# EasyEDA Pro project 主轴转接板.eprj

# Schematic 原理图
Board Name: 转接隔离板; Create Date: 2024-04-22; Page Name: 主控MCU; Project Name: 主轴转接板; Schematic Name: 原理图; Update Date: 2025-02-19; Company: 嘉立创EDA; Page Size: A3; Version: V1.0
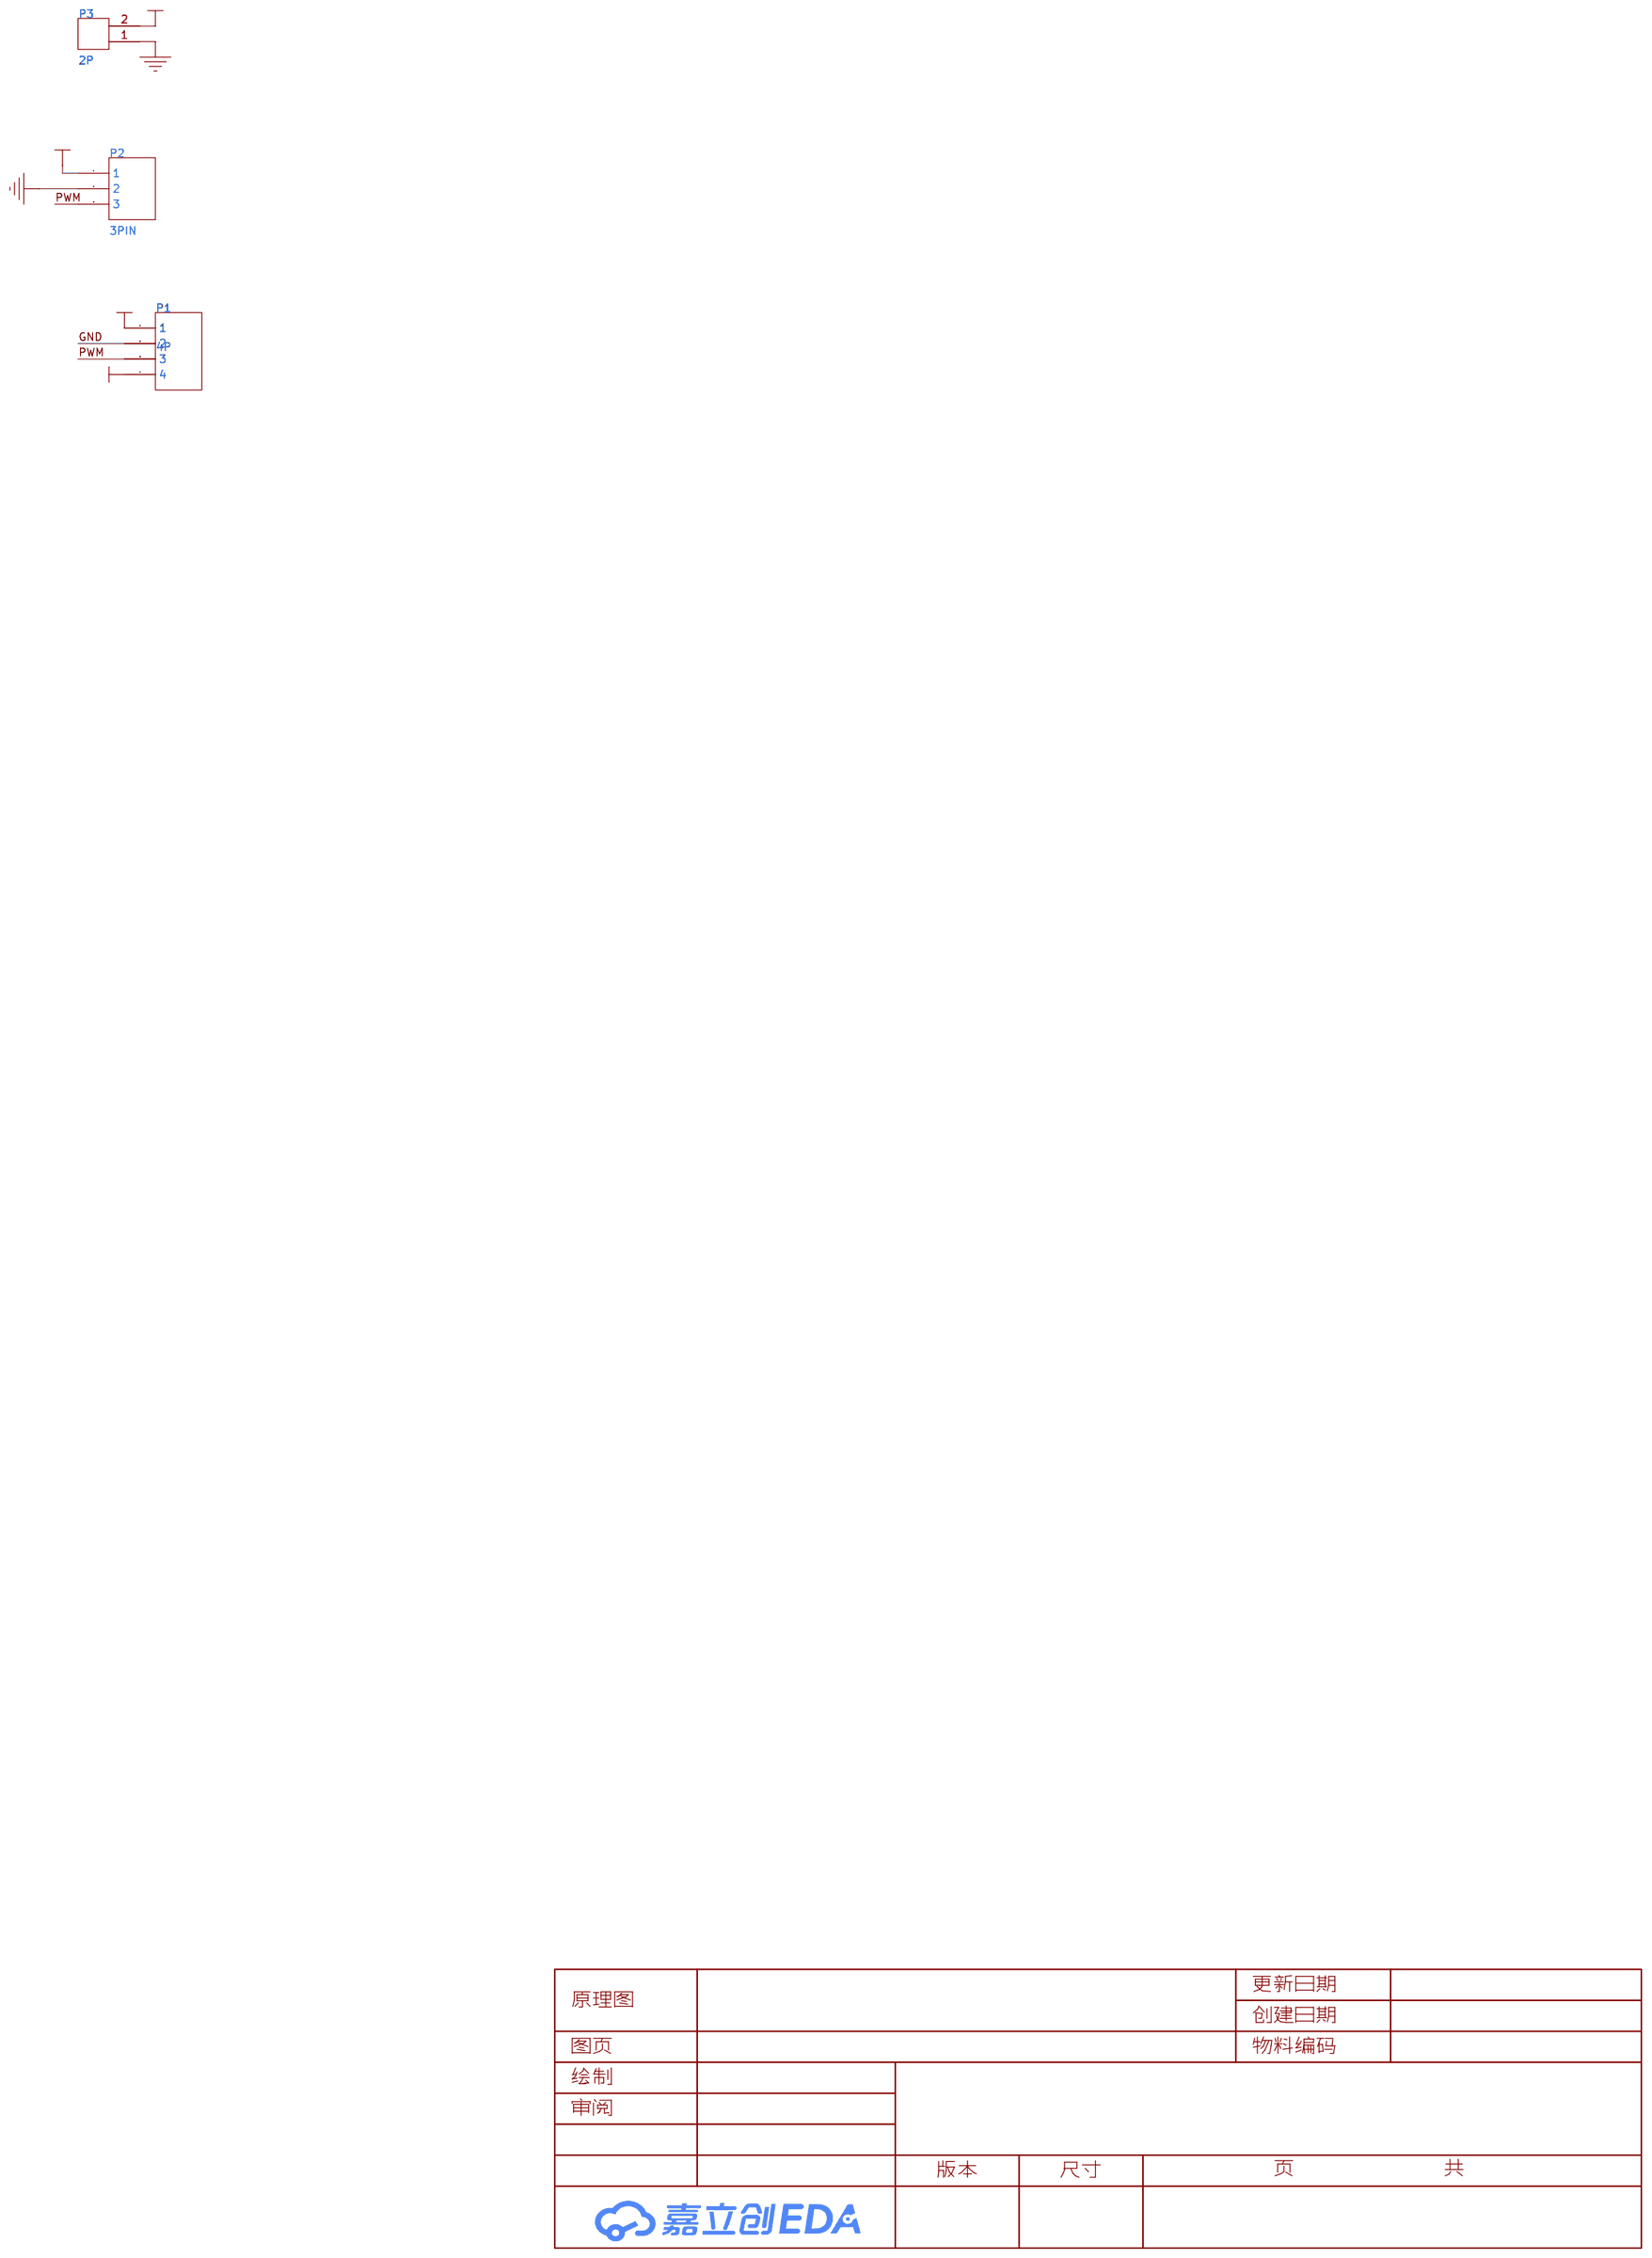
[diagram p0: schematic sheet]

## Parts
P1  4P  [SIP4]
P2  3PIN  [HDR1X3_P]
P3  2P  [HDR1X2_P]

## Library data of the parts
P1 = 4P: Library Name: SCH封装库
P2 = 3P: Library Name: SCH封装库
P3 = 2P: Library Name: SCH封装库

## Nets
12V: P1.4 P2.1
48V: P1.1 P3.2
GND: P1.2 P2.2 P3.1
PWM: P1.3 P2.3

# Board PCB
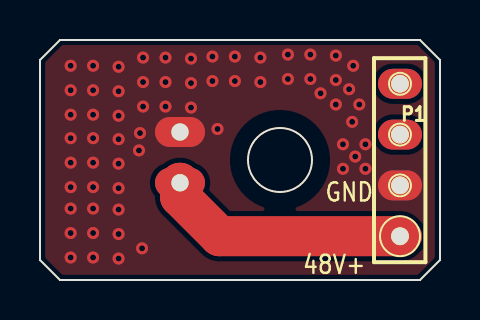
[diagram p1: board, top side]
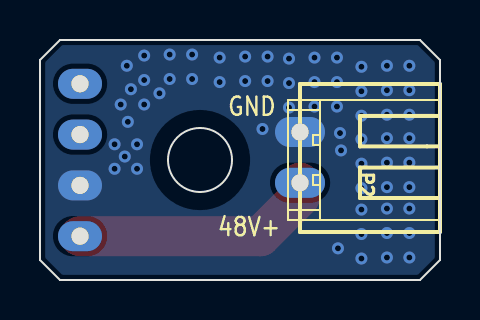
[diagram p2: board, bottom side, seen from below]

Outline 20 x 12 mm; copper layers: Top Layer, Bottom Layer. Coordinates in mm from the lower left corner of the outline.
Outline path: circle c12,6 r1.6 ; 0,11 0,1 1,0 19,0 20,1 20,11 19,12 1,12 0,11
Stack: Top Layer 0.035mm / Dielectric1 1.51mm FR4 er 4.5 / Bottom Layer 0.035mm

## Design rules (mm)
template: 用户自定义配置
spacing Default (default): track to track 0.152, other pairs 0 to 0.152
track width Default (default): min 0.254, default 0.254, max 25.4
differential pair differentialPair (default): width min 0.127, default 0.254, max 2.54; gap min 0.152, default 0.152
via Default (default): diameter min 0.25, default 0.61, max 100.025; hole min 0.2, default 0.305, max 59.995

## Placement (name value [footprint] x y rotation side)
P1  4P  [SIP4]  18 2.19 90 top
P2  3PIN  [HDR1X2_P]  7 7.4 90 bottom

## Footprints (pads in the part's own frame, mm; a bottom-side part is the same pattern mirrored in y, then rotated)
HDR1X2_P
  oval 1.5x2.5 hole 0.86: 1(0,0) 2(-2.54,0)
SIP4
  oval 1.5x2.2 hole 0.86: 1(0,0) 2(2.54,0) 3(5.08,0) 4(7.62,0)

## Nets
12V: P1.4
48V: P1.1 P2.2
GND: P1.2 P2.1
PWM: P1.3

## Via types
v1: diameter 0.6, hole 0.3, Top Layer to Bottom Layer, 63 vias

## Routing (per net, layer and track width the routed paths; a pad name or vN(x,y) marks a point on that pad's centre or on a via; arc(x,y) is an arc through that point)
48V: length 12.5
  Top Layer w2: P2.2 7,4.86 7,4.17 8.98,2.19 P1.1
GND:
  vias: v1(1.53,10.71) v1(1.53,9.49) v1(1.53,8.26) v1(1.53,7.09) v1(1.53,5.87) v1(1.53,4.64) v1(1.53,3.57) v1(1.53,2.35) v1(1.53,1.12) v1(2.65,10.71) v1(2.65,9.49) v1(2.65,8.26) v1(2.65,7.09) v1(2.65,5.87) v1(2.65,4.64) v1(2.65,3.57) v1(2.65,2.35) v1(2.65,1.12) v1(3.93,10.66) v1(3.93,9.44) v1(3.93,8.21) v1(3.93,7.04) v1(3.93,5.82) v1(3.93,4.59) v1(3.93,3.52) v1(3.93,2.3) v1(3.93,1.07) v1(5,7.35) v1(4.95,6.48) v1(5.1,1.58) v1(5.15,11.12) v1(5.15,9.9) v1(5.15,8.67) v1(6.28,11.12) v1(6.28,9.9) v1(6.28,8.67) v1(7.55,11.07) v1(7.55,9.85) v1(7.55,8.62) v1(8.62,11.17) v1(8.62,9.95) v1(8.88,7.55) v1(9.74,11.17) v1(9.74,9.95) v1(11.02,11.12) v1(11.02,9.9) v1(12.4,11.27) v1(12.4,10.05) v1(13.52,11.27) v1(13.52,10.05) v1(14.03,9.34) v1(14.79,11.22) v1(14.79,10) v1(14.79,8.77) v1(15.15,6.79) v1(15.15,5.56) v1(15.46,9.54) v1(15.61,7.91) v1(15.66,10.71) v1(15.76,6.17) v1(15.97,8.77) v1(16.27,6.79) v1(16.27,5.56)

## Copper pours and planes (outline as drawn; the poured copper is in the pictures)
GND on Top Layer: -0.55,12.58 20.67,12.58 20.67,-0.53 -0.55,-0.53
GND on Bottom Layer: -0.6,12.68 20.57,12.68 20.57,-0.58 -0.6,-0.58

## Text on the board
Bottom Silkscreen Layer: GND | 48V+
Top Silkscreen Layer: 48V+ | GND

# Board PCB_1
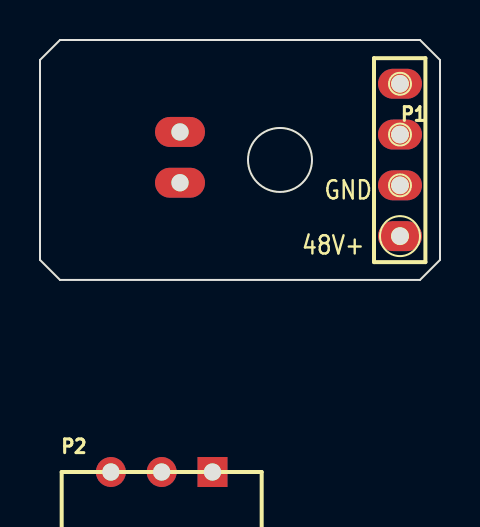
[diagram p3: board, top side]
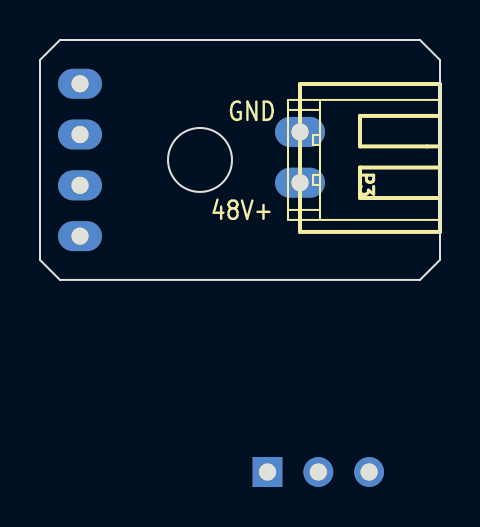
[diagram p4: board, bottom side, seen from below]

Outline 20 x 12 mm; copper layers: Top Layer, Bottom Layer. Coordinates in mm from the lower left corner of the outline.
Outline path: circle c12,6 r1.6 ; 0,11 0,1 1,0 19,0 20,1 20,11 19,12 1,12 0,11
Stack: Top Layer 0.035mm / Dielectric1 1.51mm FR4 er 4.5 / Bottom Layer 0.035mm

## Design rules (mm)
template: 用户自定义配置
spacing Default (default): track to track 0.152, other pairs 0 to 0.152
track width Default (default): min 0.254, default 0.254, max 25.4
differential pair differentialPair (default): width min 0.127, default 0.254, max 2.54; gap min 0.152, default 0.152
via Default (default): diameter min 0.25, default 0.61, max 100.025; hole min 0.2, default 0.305, max 59.995

## Placement (name value [footprint] x y rotation side)
P1  4P  [SIP4]  18 2.19 90 top
P2  3PIN  [HDR1X3_P]  6.08 -9.61 0 top
P3  2P  [HDR1X2_P]  7 7.4 90 bottom

## Footprints (pads in the part's own frame, mm; a bottom-side part is the same pattern mirrored in y, then rotated)
HDR1X2_P
  oval 1.5x2.5 hole 0.86: 1(0,0) 2(-2.54,0)
HDR1X3_P
  rect 1.5x1.5 hole 0.86: 1(2.54,0)
  round 1.5 hole 0.86: 2(0,0) 3(-2.54,0)
SIP4
  oval 1.5x2.2 hole 0.86: 1(0,0) 2(2.54,0) 3(5.08,0) 4(7.62,0)

## Nets
12V: P1.4 P2.1
48V: P1.1 P3.2
GND: P1.2 P2.2 P3.1
PWM: P1.3 P2.3

## Text on the board
Bottom Silkscreen Layer: GND | 48V+
Top Silkscreen Layer: 48V+ | GND
